# Altium schematic sheet CW2015.SchDoc
size A4
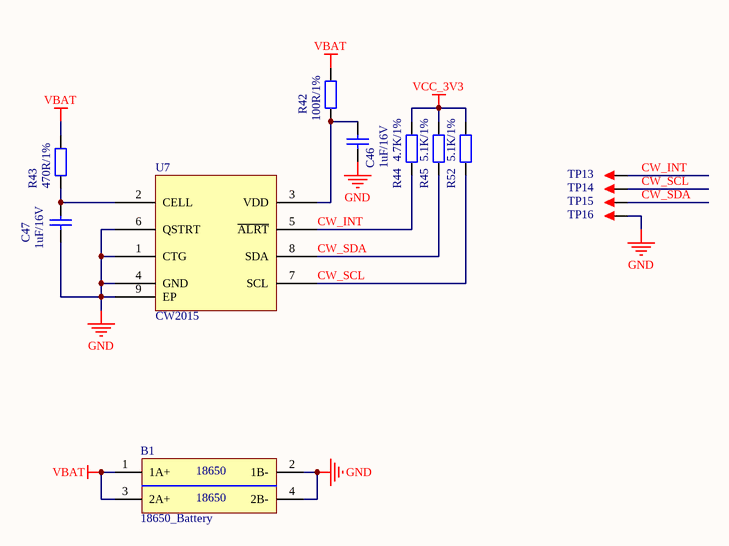
[diagram p0: CW2015.SchDoc]

## Parts
B1  18650_Battery  [18650*2]
C46  1uF/16V  [C0402_L]
C47  1uF/16V  [C0402_L]
R42  100R/1%  [R0402_L]
R43  470R/1%  [R0402_L]
R44  4.7K/1%  [R0402_L]
R45  5.1K/1%  [R0402_L]
R52  5.1K/1%  [R0402_L]
TP13  TEST  [TEST 1]  (value not drawn)
TP14  TEST  [TEST 1]  (value not drawn)
TP15  TEST  [TEST 1]  (value not drawn)
TP16  TEST  [TEST 1]  (value not drawn)
U7  CW2015  [CW2015]

## Nets
GND: B1.2(1B-) B1.4(2B-) C46.2 C47.1 TP16.1 U7.1(CTG) U7.4(GND) U7.6(QSTRT) U7.9(EP)
VBAT: B1.1(1A+) B1.3(2A+) R42.2 R43.2
VCC_3V3: R44.2 R45.2 R52.2
CW_INT: R44.1 TP13.1 U7.5(~{ALRT})
CW_SCL: R52.1 TP14.1 U7.7(SCL)
CW_SDA: R45.1 TP15.1 U7.8(SDA)
NetC46_1: C46.1 R42.1 U7.3(VDD)
NetC47_2: C47.2 R43.1 U7.2(CELL)

## Notes on the sheet
- (in symbol 18650_Battery) 18650

## Library data of the parts
B1 = 18650_Battery: 18650电池盒
C46 C47 = C: 贴片电容; BOM名称: 无极性贴片电容; 联系卖家，免费查找封装: 唯一出售店铺网址https://shop463601444.taobao.com
R42-R45 R52 = R: 贴片电阻; 联系卖家，免费查找封装: 唯一出售店铺网址https://shop463601444.taobao.com; BOM名称: 贴片电阻
TP13-TP16 = TEST: 测试点; 联系卖家，免费查找封装: 唯一出售店铺网址https://shop463601444.taobao.com; 封装库来自淘宝卖家ID：黄晶宝石: 其他店铺购入均为盗版假冒封装库，请立即申请退款; BOM名称: 测试点
U7 = CW2015: 电量计